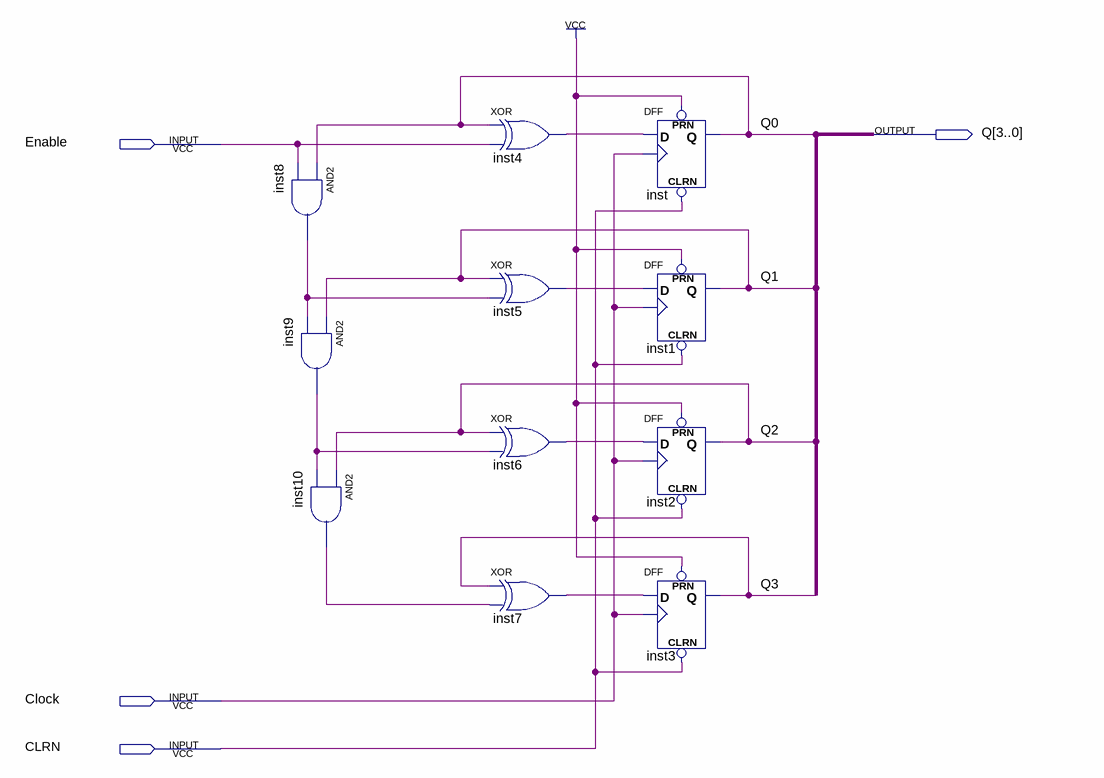
[diagram p0: schematic sheet]
// Quartus schematic lab10step2a.bdf as structural Verilog: 11 symbols, 4 pins
module lab10step2a (
  input  Enable,
  input  Clock,
  input  CLRN,
  output [3:0] Q
);

  wire inst4_out, inst5_out, inst6_out, inst7_out, inst8_out, inst9_out, inst10_out;

  and inst8 (inst8_out, Q[0], Enable);
  and inst9 (inst9_out, Q[1], inst8_out);
  and inst10 (inst10_out, Q[2], inst9_out);
  xor inst4 (inst4_out, Q[0], Enable);
  xor inst5 (inst5_out, Q[1], inst8_out);
  xor inst6 (inst6_out, Q[2], inst9_out);
  xor inst7 (inst7_out, Q[3], inst10_out);
  DFF inst (.CLRN(CLRN), .CLK(Clock), .D(inst4_out), .PRN(1'b1), .Q(Q[0]));
  DFF inst1 (.CLRN(CLRN), .CLK(Clock), .D(inst5_out), .PRN(1'b1), .Q(Q[1]));
  DFF inst2 (.CLRN(CLRN), .CLK(Clock), .D(inst6_out), .PRN(1'b1), .Q(Q[2]));
  DFF inst3 (.CLRN(CLRN), .CLK(Clock), .D(inst7_out), .PRN(1'b1), .Q(Q[3]));
endmodule
